# EAGLE design activity_monitor_v1 (EAGLE 6.4)
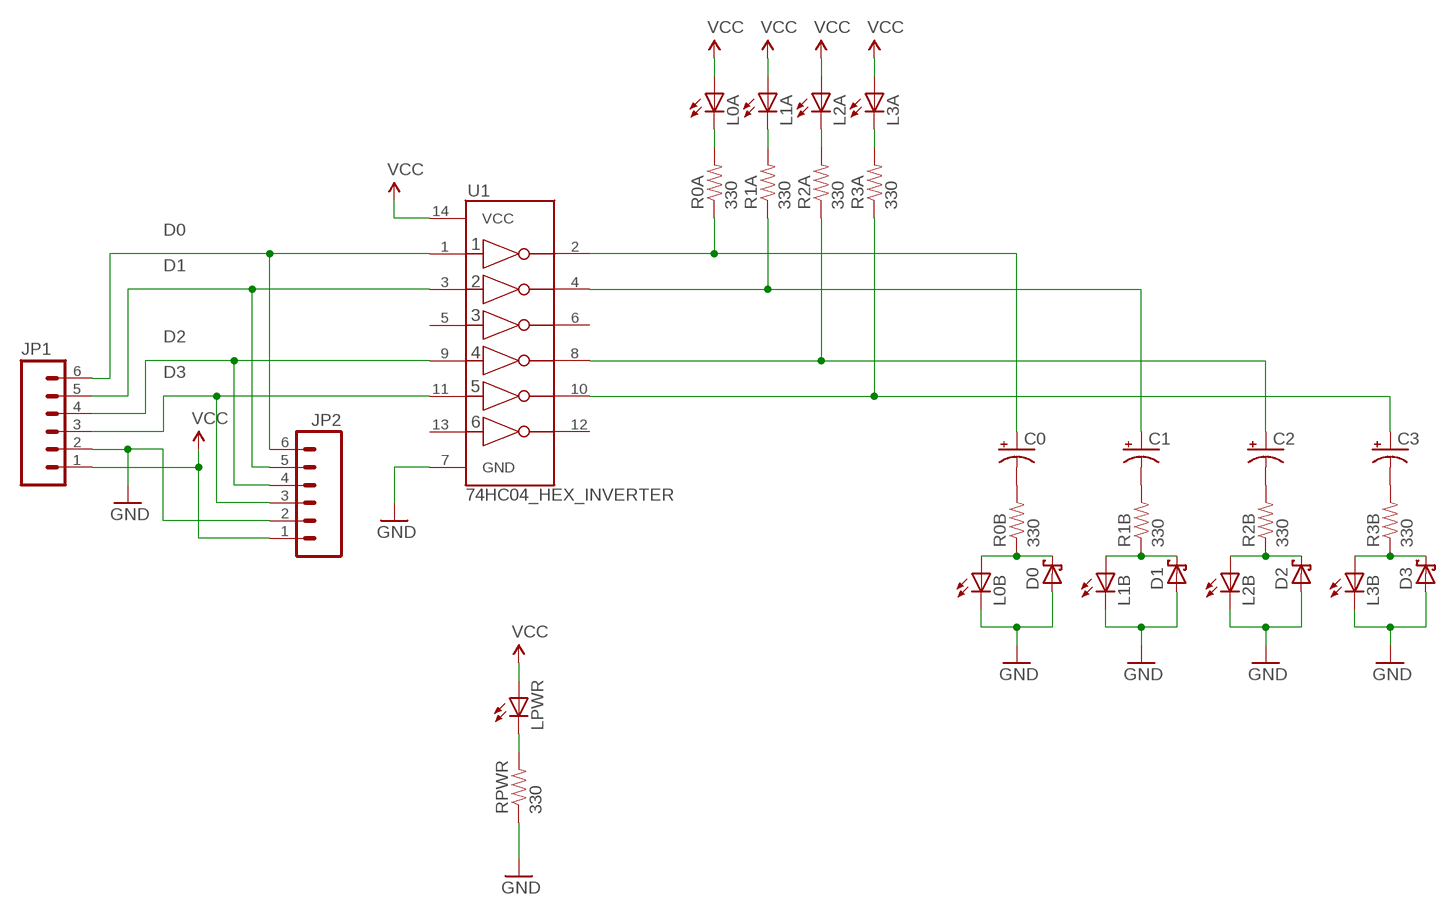
[diagram p0: schematic, sheet 1]

## Parts
C0  CAP_POLPTH2  [CPOL-RADIAL-10UF-25V]
C1  CAP_POLPTH2  [CPOL-RADIAL-10UF-25V]
C2  CAP_POLPTH2  [CPOL-RADIAL-10UF-25V]
C3  CAP_POLPTH2  [CPOL-RADIAL-10UF-25V]
D0  SCHOTTKY-DIODEDO35-7  [DO35-7]
D1  SCHOTTKY-DIODEDO35-7  [DO35-7]
D2  SCHOTTKY-DIODEDO35-7  [DO35-7]
D3  SCHOTTKY-DIODEDO35-7  [DO35-7]
JP1  M06SIP  [1X06]
JP2  M06SIP  [1X06]
L0A  LED3MM  [LED3MM]
L0B  LED3MM  [LED3MM]
L1A  LED3MM  [LED3MM]
L1B  LED3MM  [LED3MM]
L2A  LED3MM  [LED3MM]
L2B  LED3MM  [LED3MM]
L3A  LED3MM  [LED3MM]
L3B  LED3MM  [LED3MM]
LPWR  LED3MM  [LED3MM]
R0A  330  RESISTORPTH-1/4W  [AXIAL-0.4]
R0B  330  RESISTORPTH-1/4W  [AXIAL-0.4]
R1A  330  RESISTORPTH-1/4W  [AXIAL-0.4]
R1B  330  RESISTORPTH-1/4W  [AXIAL-0.4]
R2A  330  RESISTORPTH-1/4W  [AXIAL-0.4]
R2B  330  RESISTORPTH-1/4W  [AXIAL-0.4]
R3A  330  RESISTORPTH-1/4W  [AXIAL-0.4]
R3B  330  RESISTORPTH-1/4W  [AXIAL-0.4]
RPWR  330  RESISTORPTH-1/4W  [AXIAL-0.4]
U1  74HC04_HEX_INVERTER  [DIL14]

## Nets
D0: JP1.6 JP2.6 U1.1(1A)
D1: JP1.5 JP2.5 U1.3(2A)
D2: JP1.4 JP2.4 U1.9(4A)
D3: JP1.3 JP2.3 U1.11(5A)
GND: D0.A D1.A D2.A D3.A JP1.2 JP2.2 L0B.K(C) L1B.K(C) L2B.K(C) L3B.K(C) RPWR.P$1 U1.7(GND)
N$1: C0.1(+) R0A.P$1 U1.2(1Y)
N$2: C1.1(+) R1A.P$1 U1.4(2Y)
N$3: C2.1(+) R2A.P$1 U1.8(4Y)
N$4: C3.1(+) R3A.P$1 U1.10(5Y)
N$5: L0A.K(C) R0A.P$2
N$6: L1A.K(C) R1A.P$2
N$7: L2A.K(C) R2A.P$2
N$8: L3A.K(C) R3A.P$2
N$9: C0.2(-) R0B.P$2
N$10: D0.C L0B.A R0B.P$1
N$12: C1.2(-) R1B.P$2
N$13: LPWR.K(C) RPWR.P$2
N$15: C2.2(-) R2B.P$2
N$18: C3.2(-) R3B.P$2
R1B: D1.C L1B.A R1B.P$1
R2B: D2.C L2B.A R2B.P$1
R3B: D3.C L3B.A R3B.P$1
VCC: JP1.1 JP2.1 L0A.A L1A.A L2A.A L3A.A LPWR.A U1.14(VCC)
Unconnected: U1.5(3A) U1.6(3Y) U1.12(6Y) U1.13(6A)

## Library data of the parts
C0 C1-C3 = SparkFun-Capacitors:CAP_POL: Capacitor Polarized These are standard SMD and PTH capacitors. Normally 10uF, 47uF, and 100uF in electrolytic and tantalum varieties. Always verify the external diameter of the through hole cap, it varies with capacity, voltage, and manufacturer. The EIA devices should be standard.
D0 D1-D3 = diode:SCHOTTKY-DIODE: Schottky Diode
JP1 JP2 = SparkFun-Connectors:M06: Header 6 Standard 6-pin 0.1" header. Use with straight break away headers (SKU : PRT-00116), right angle break away headers (PRT-00553), swiss pins (PRT-00743), machine pins (PRT-00117), and female headers (PRT-00115). Molex polarized connector foot print use with SKU : PRT-08094 with associated crimp pins and housings. NOTES ON THE VARIANTS LOCK and LOCK_LONGPADS... This footprint was designed to help hold the alignment of a through-hole component (i.e. 6-pin header) while soldering it into place. You may notice that each hole has been shifted either up or down by 0.005 of an inch from it's more standard position (which is a perfectly straight line). This slight alteration caused the pins (the squares in the middle) to touch the edges of the holes. Because they are alternating, it causes a "brace" to hold the component in place. 0.005 has proven to be the perfect amount of "off-center" position when using our standard breakaway headers. Although looks a little odd when you look at the bare footprint, once you have a header in there, the alteration is very hard to notice. Also,if you push a header all the way into place, it is covered up entirely on the bottom side. This idea of altering the position of holes to aid alignment will be further integrated into the Sparkfun Library for other footprints. It can help hold any component with 3 or more connection pins.
L0A L0B L1A L1B L2A L2B L3A L3B LPWR = SparkFun-LED:LED: LEDs Standard schematic elements and footprints for 5mm, 3mm, 1206, and 0603 sized LEDs. 5mm - Spark Fun Electronics SKU : COM-00529 (and others)
R0A R0B R1A R1B R2A R2B R3A R3B RPWR = SparkFun-Passives:RESISTOR: Resistor Basic schematic elements and footprints for 0603, 1206, and PTH resistors.
U1 = SparkFun-DigitalIC:74HC04_HEX_INVERTER: 74HC04 Hex Inverter

## Net classes
0 default: width 0.254 mm, clearance 0.254 mm

## Board
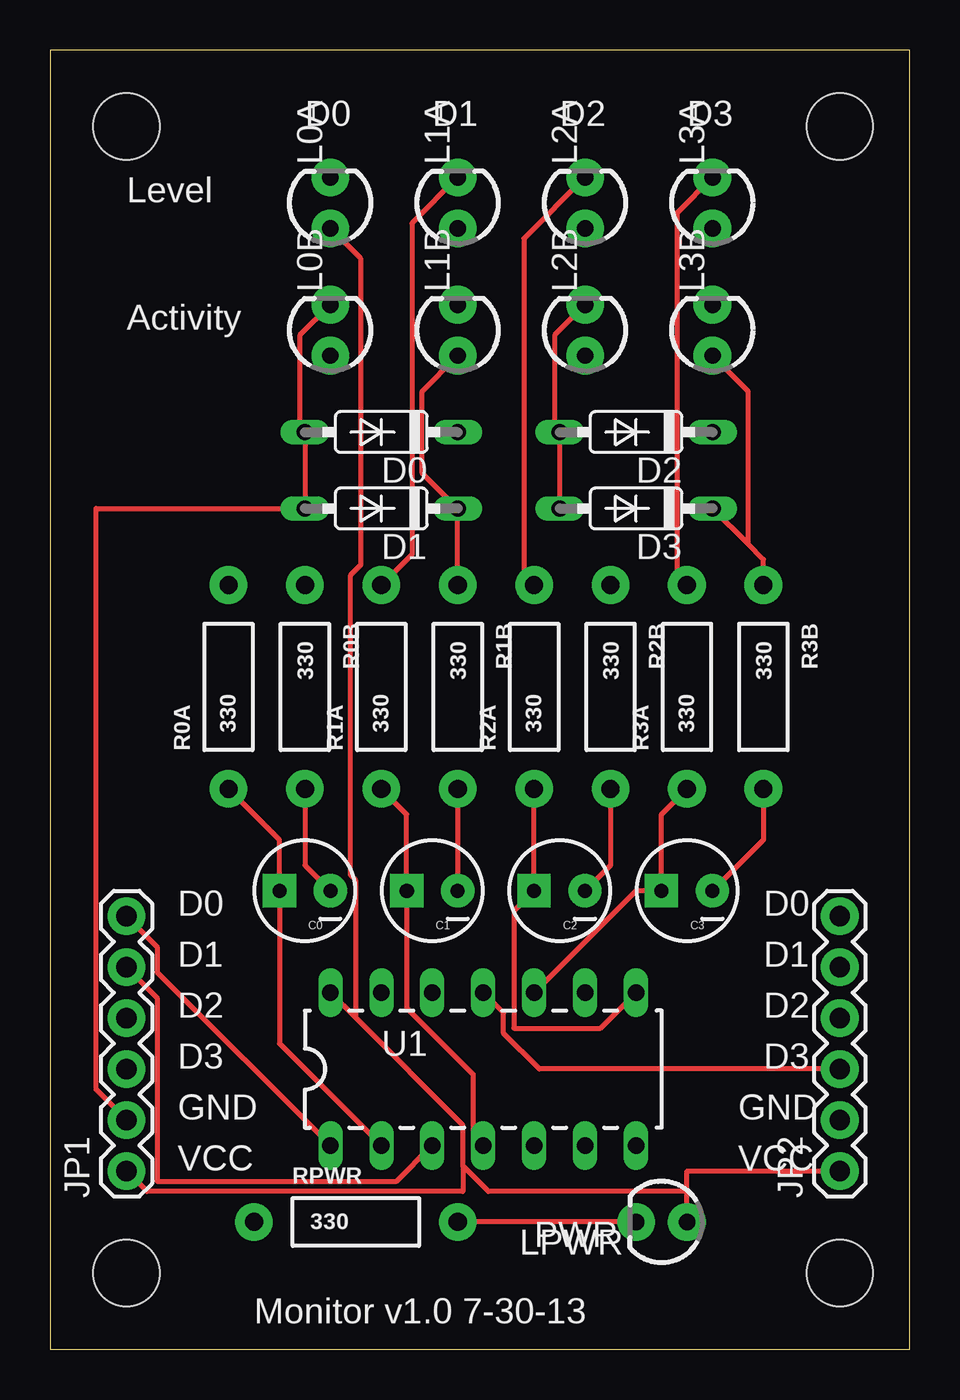
[diagram p1: board, top side]
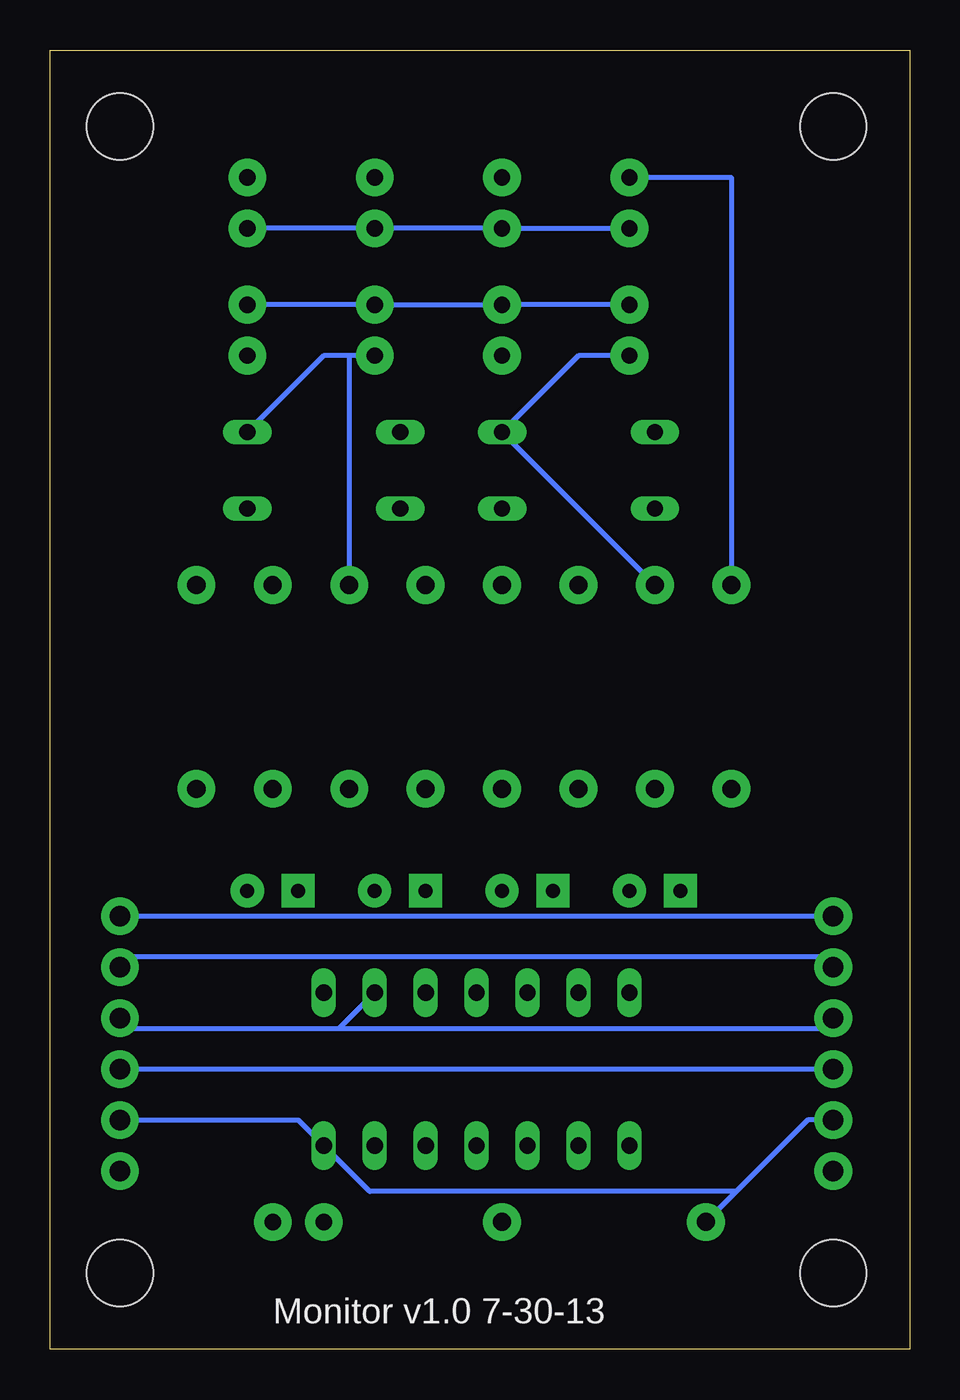
[diagram p2: board, bottom side, seen from below]

Size 42.85 x 64.76 mm. Coordinates in mm from the lower left corner, seen from the top.
Outline: 0,0 42.85,0 42.85,64.76 0,64.76 0,0
Copper layers (1*16): Top 0.0356mm / dielectric 1.5011mm / Bottom 0.0356mm
Design rules "OSHPark *": minimum track width 6mil, minimum drill 13mil, track to track 6mil, track to pad 6mil, pad to pad 6mil, via to via 6mil, smd to smd 6mil, copper to edge 15mil, drill to drill 6mil, minimum pad ring 7mil, minimum via ring 7mil, stop-mask expansion 4mil, vias tented up to drill 0mil, thermal gap 10mil

### Footprints (pad centres in the part's own frame; a part is rotated, then mirrored left to right if it is on the bottom)
CPOL-RADIAL-10UF-25V = drill 0.7 pad 1.651 square: 1 1.27,0 | drill 0.7 pad 1.651: 2 -1.27,0
DO35-7 = drill 0.813 long: A 3.81,0; C -3.81,0
1X06 = drill 1.016 pad 1.88: 1 0,0; 2 2.54,0; 3 5.08,0; 4 7.62,0; 5 10.16,0; 6 12.7,0
LED3MM = drill 0.813 pad 1.88: A -1.27,0; K 1.27,0
AXIAL-0.4 = drill 0.9 pad 1.88: P$1 -5.08,0; P$2 5.08,0
DIL14 = drill 0.813 long: 1 -8.89,-3.81; 2 -6.35,-3.81; 3 -3.81,-3.81; 4 -1.27,-3.81; 5 1.27,-3.81; 6 3.81,-3.81; 7 6.35,-3.81; 8 6.35,3.81; 9 3.81,3.81; 10 1.27,3.81; 11 -1.27,3.81; 12 -3.81,3.81; 13 -6.35,3.81; 14 -8.89,3.81
STAND-OFF = hole 3.302: 0,0

### Placement (x,y rotation side)
C0  12.7,22.86 180 top
C1  19.05,22.86 180 top
C2  25.4,22.86 180 top
C3  31.75,22.86 180 top
D0  16.51,45.72 180 top
D1  16.51,41.91 180 top
D2  29.21,45.72 180 top
D3  29.21,41.91 180 top
JP1  3.81,8.89 90 top
JP2  39.37,8.89 90 top
L0A  13.97,57.15 90 top
L0B  13.97,50.8 90 top
L1A  20.32,57.15 90 top
L1B  20.32,50.8 90 top
L2A  26.67,57.15 90 top
L2B  26.67,50.8 90 top
L3A  33.02,57.15 90 top
L3B  33.02,50.8 90 top
LPWR  30.48,6.35 180 top
R0A  8.89,33.02 90 top
R0B  12.7,33.02 270 top
R1A  16.51,33.02 90 top
R1B  20.32,33.02 270 top
R2A  24.13,33.02 90 top
R2B  27.94,33.02 270 top
R3A  31.75,33.02 90 top
R3B  35.56,33.02 270 top
RPWR  15.24,6.35 0 top
U1  22.86,13.97 0 top
U$1  [STAND-OFF]  3.81,60.96 0 top
U$2  [STAND-OFF]  39.37,60.96 0 top
U$3  [STAND-OFF]  3.81,3.81 0 top
U$4  [STAND-OFF]  39.37,3.81 0 top

### Tracks (layer width: path | path; a pad name or v marks a point on that pad's centre or on a via)
D0
  Top 0.254: U1.1 5.33,18.8 5.33,20.07 JP1.6
  Bottom 0.254: JP1.6 JP2.6
D1
  Top 0.254: U1.3 17.27,8.38 5.33,8.38 5.33,17.53 JP1.5
  Bottom 0.254: JP2.5 38.86,19.56 4.32,19.56 JP1.5
D2
  Bottom 0.254: 28.45,16 U1.9 | 28.45,16 38.86,16 JP2.4 | JP1.4 4.32,16 28.45,16
D3
  Top 0.254: U1.11 22.61,16.76 22.61,15.75 24.38,13.97 JP2.3
  Bottom 0.254: JP2.3 JP1.3
GND
  Top 0.254: L0B.K 12.45,50.55 12.45,45.97 D0.A D1.A 2.29,41.91 2.29,12.95 JP1.2 | D3.A D2.A 25.15,45.97 25.15,50.55 L2B.K
  Bottom 0.254: L0B.K L1B.K L2B.K L3B.K | JP2.2 30.48,11.43 U1.7 26.92,7.87 8.64,7.87 | 8.64,7.87 5.08,11.43 JP1.2 | 8.64,7.87 RPWR.P$1
N$1
  Top 0.254: U1.2 11.43,15.24 C0.1 11.43,25.4 R0A.P$1
N$2
  Top 0.254: U1.4 21.08,10.67 21.08,13.72 17.78,17.02 C1.1 17.78,26.67 R1A.P$1
N$3
  Top 0.254: U1.8 27.43,16 23.11,16 23.11,21.84 C2.1 R2A.P$1
N$4
  Top 0.254: U1.10 29.21,22.86 C3.1 30.48,26.67 R3A.P$1
N$5
  Bottom 0.254: R0A.P$2 8.89,58.42 L0A.K
N$6
  Top 0.254: R1A.P$2 18.03,39.62 18.03,56.13 L1A.K
N$7
  Top 0.254: R2A.P$2 23.62,38.61 23.62,55.37 L2A.K
N$8
  Top 0.254: R3A.P$2 31.24,38.61 31.24,56.64 L3A.K
N$9
  Top 0.254: C0.2 12.7,24.13 R0B.P$2
N$10
  Bottom 0.254: L0B.A 16.51,49.53 D0.C R0B.P$1
N$12
  Top 0.254: R1B.P$2 C1.2
N$13
  Top 0.254: LPWR.K RPWR.P$2
N$15
  Top 0.254: C2.2 27.94,24.13 R2B.P$2
N$18
  Top 0.254: C3.2 35.56,25.4 R3B.P$2
R1B
  Top 0.254: R1B.P$1 D1.C 18.54,43.69 18.54,47.75 L1B.A
R2B
  Bottom 0.254: D2.C 29.21,49.53 27.94,49.53 | L2B.A 27.94,49.53 | 27.94,49.53 R2B.P$1
R3B
  Top 0.254: 34.8,40.13 35.56,39.37 R3B.P$1 | 34.8,40.13 D3.C | L3B.A 34.8,47.75 34.8,40.13
VCC
  Top 0.254: 15.24,16.51 20.57,11.18 20.57,9.14 | 15.24,16.51 U1.14 | 20.57,9.14 21.84,7.87 31.75,7.87 | LPWR.A 31.75,7.87 | JP1.1 4.83,7.87 20.57,7.87 20.57,9.14 | JP2.1 31.75,8.89 31.75,7.87 | L0A.A 15.49,54.36 15.49,39.12 14.99,38.61 14.99,23.62 15.24,23.37 15.24,16.51
  Bottom 0.254: L0A.A L1A.A L2A.A L3A.A

### Text on the board
tPlace: D0 | D1 | D2 | D3 | Level | Activity | D0 | D0 | D1 | D1 | D2 | D2 | D3 | D3 | GND | GND | VCC | VCC | PWR | Monitor v1.0 7-30-13
bPlace: Monitor v1.0 7-30-13